# Altium schematic sheet Sheet5.SchDoc
size B
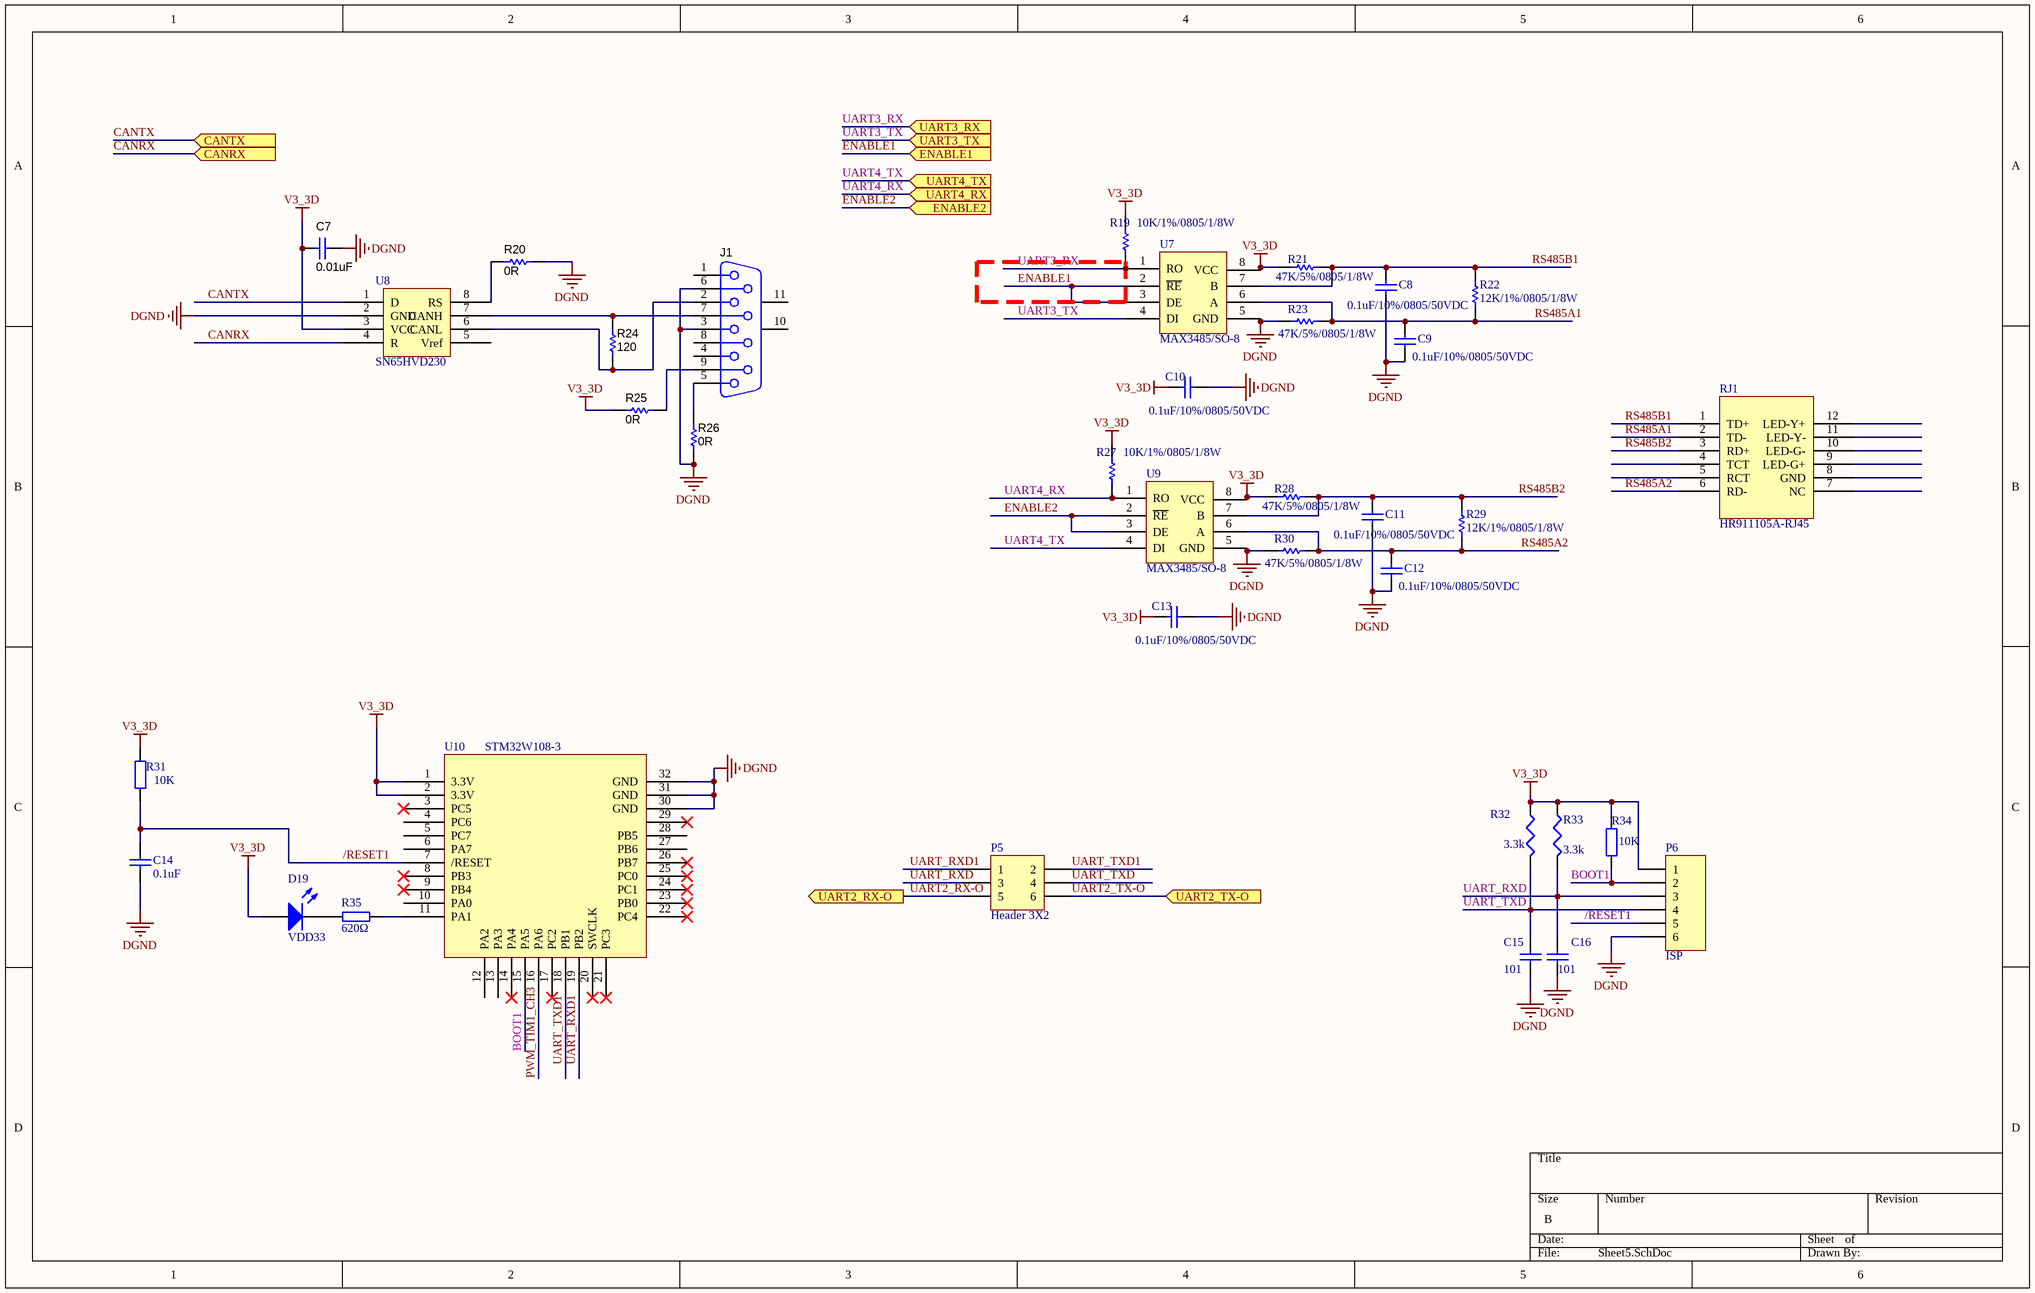
[diagram p0: Sheet5.SchDoc]

## Parts
C7  ValueDisplayed: 0.01uF  [0805_cap]
C8  0.1uF/10%/0805/50VDC  [C-0805]
C9  0.1uF/10%/0805/50VDC  [C-0805]
C10  0.1uF/10%/0805/50VDC  [C-0805]
C11  0.1uF/10%/0805/50VDC  [C-0805]
C12  0.1uF/10%/0805/50VDC  [C-0805]
C13  0.1uF/10%/0805/50VDC  [C-0805]
C14  0.1uF  [C0805]
C15  101  [C0805]
C16  101  [C0805]
D19  VDD33  [0805LED]
J1  (no value)  [CONN_1734348-1]
P5  Header 3X2  [HDR2X3]
P6  ISP  [SIP-6B]
R19  10K/1%/0805/1/8W  [R-0805]
R20  value 0R  [0805_HV]  (hidden comment: CRCW080560R4FKEA)
R21  47K/5%/0805/1/8W  [R-0805]
R22  12K/1%/0805/1/8W  [R-0805]
R23  47K/5%/0805/1/8W  [R-0805]
R24  value 120  [0805_HV]  (hidden comment: CRCW080560R4FKEA)
R25  value 0R  [0805_HV]  (hidden comment: CRCW080560R4FKEA)
R26  value 0R  [0805_HV]  (hidden comment: CRCW080560R4FKEA)
R27  10K/1%/0805/1/8W  [R-0805]
R28  47K/5%/0805/1/8W  [R-0805]
R29  12K/1%/0805/1/8W  [R-0805]
R30  47K/5%/0805/1/8W  [R-0805]
R31  value 10K  [0805]  (hidden comment: Res2)
R32  3.3k  [R0805]
R33  3.3k  [R0805]
R34  value 10K  [R0805]  (hidden comment: Res2)
R35  620Ω  [R0805]
RJ1  HR911105A-RJ45  [HR911105A]
U7  MAX3485/SO-8  [SO-G8]
U8  SN65HVD230  [SO-G8]
U9  MAX3485/SO-8  [SO-G8]
U10  STM32W108-3  [STM32W108-3]

## Ports
CANRX (in), CANTX (in), ENABLE1 (in), ENABLE2 (in), UART2_RX-O (out), UART2_TX-O (in), UART3_RX (in), UART3_TX (in), UART4_RX (in), UART4_TX (in)

## Nets
DGND: C7.2 C8.1 C9.1 C10.2 C11.1 C12.1 C13.2 C14.1 C15.1 C16.1 J1.3 J1.6 P6.6 R20.2 R23.2 R26.1 R30.2 U7.5(GND) U8.2(GND) U9.5(GND) U10.30(GND) U10.31(GND) U10.32(GND)
V3_3D: C7.1 C10.1 C13.1 D19.1(A) P6.1 R19.2 R21.2 R25.2 R27.2 R28.2 R31.2 R32.1 R33.1 R34.2 U7.8(VCC) U8.3(VCC) U9.8(VCC) U10.1(3.3V) U10.2(3.3V)
/RESET1: C14.2 P6.5 R31.1 U10.7(/RESET)
BOOT1: P6.2 R34.1 U10.15(PA5)
CANRX: U8.4(R) ; port CANRX
CANTX: U8.1(D) ; port CANTX
ENABLE1: U7.2(~{RE}) U7.3(DE) ; port ENABLE1
ENABLE2: U9.2(~{RE}) U9.3(DE) ; port ENABLE2
PWM_TIM1_CH3: U10.16(PA6)
RS485A1: C9.2 R22.1 R23.1 RJ1.2(TD-) U7.6(A)
RS485A2: C12.2 R29.1 R30.1 RJ1.6(RD-) U9.6(A)
RS485B1: C8.2 R21.1 R22.2 RJ1.1(TD+) U7.7(B)
RS485B2: C11.2 R28.1 R29.2 RJ1.3(RD+) U9.7(B)
UART2_RX-O: P5.5 ; port UART2_RX-O
UART2_TX-O: P5.6 ; port UART2_TX-O
UART3_RX: R19.1 U7.1(RO) ; port UART3_RX
UART3_TX: U7.4(DI) ; port UART3_TX
UART4_RX: R27.1 U9.1(RO) ; port UART4_RX
UART4_TX: U9.4(DI) ; port UART4_TX
UART_RXD: C16.2 P5.3 P6.3 R33.2
UART_RXD1: P5.1 U10.19(PB2)
UART_TXD: C15.2 P5.4 P6.4 R32.2
UART_TXD1: P5.2 U10.18(PB1)
NetD19_2: D19.2(K) R35.2
NetJ1_2: J1.2 R24.2 U8.6(CANL)
NetJ1_5: J1.5 R26.2
NetJ1_7: J1.7 R24.1 U8.7(CANH)
NetJ1_9: J1.9 R25.1
NetR20_1: R20.1 U8.8(RS)
NetR35_1: R35.1 U10.11(PA1)

Not connected (* = marked no-connect by the designer): J1 1 4 8 10(MH1) 11(MH2); RJ1 4(TCT) 5(RCT) 7(NC) 8(GND) 9(LED-G+) 10(LED-G-) 11(LED-Y-) 12(LED-Y+); U8 5(Vref); U10 3(PC5)* 4(PC6) 5(PC7) 6(PA7) 8(PB3)* 9(PB4)* 10(PA0) 12(PA2) 13(PA3) 14(PA4)* 17(PC2)* 20(SWCLK)* 21(PC3)* 22(PC4)* 23(PB0)* 24(PC1)* 25(PC0)* 26(PB7)* 27(PB6) 28(PB5) 29*

## Library data of the parts
C7 = C1005X7R1C103K: CAP, CERM, 0.01uF, 16V, +/-10%, X7R, 0402; Manufacturer: TDK; Polarized: N; CompType: Capacitor; U/M: EA; Cap_F: 0.00000001; Tolerance_%: 10; ESR_Ohm: 0.0623; Value1: 0.0623 ohm; VDC_V: 16; TaMin_C: -55; TaMax_C: 125; Cap_Case: 0402; SymbolVersion: 2008-07-09; Value: 0.01uF; PartNumber: C1005X7R1C103K; PackageReference: 0402; RoHS: Y; Value2: 16V; MountType: SMT; Technology: Ceramic; Published: 2008-06-19; Publisher: Texas Instruments; LatestRevisionDate: 2013-04-19; LatestRevisionNote: Changed publisher; ComponentLink1Description: Datasheet link; ComponentLink1URL: http://www.tdk.co.jp/tefe02/e412_c.pdf; Supplier 1: Digi-Key; Supplier Part Number 1: 445-1262-1-ND; Supplier 2: Farnell; Supplier Part Number 2: 1844125
C8-C13 = ASC-0024CA: 名称: 贴片电容; 型号: CGA4J2X8R1H104K125AA; 品牌: TDK; 规格: 0.1uF/10%/0805/50VDC
C14-C16 = Cap: Capacitor; Value: 100pF; Published: 8-Jun-2000; LatestRevisionDate: 17-Jul-2002; LatestRevisionNote: Re-released for DXP Platform.; Publisher: Altium Limited
D19 = LED3: Typical BLUE SiC LED; Published: 8-Jun-2000; LatestRevisionDate: 17-Dec-2003; LatestRevisionNote: PCB Footprint replaced.; Publisher: Altium Limited
J1 = 1734348-1: Conn D-SUB RCPT R/A 9POS GOLD/FL, TH; Manufacturer: TE Connectivity; SymbolCreator: a0412235; CompType: Connector; U/M: EA; SymbolVersion: 2012-11-29; PartNumber: 1734348-1; RoHS: Y; PackageReference: D-SUB 9 PIN; MountType: TH; ComponentLink1Description: Datasheet Link; ComponentLink1URL: http://www.te.com/commerce/DocumentDelivery/DDEController?Action=showdoc&DocId=Customer+Drawing%7F1734348%7FB1%7Fpdf%7FEnglish%7FENG_CD_1734348_B1.pdf%7F1734348-1; Publisher: Texas Instruments; LatestRevisionDate: 2013-04-26; Supplier 1: Digi-Key; Supplier Part Number 1: A35109-ND; Supplier 2: Mouser; Supplier Part Number 2: 571-1734348-1; Supplier 3: Farnell; Supplier Part Number 3: 2133699
P5 = Header 3X2: Header, 3-Pin, Dual row; LatestRevisionDate: 17-Jul-2002; LatestRevisionNote: Re-released for DXP Platform.; Publisher: Altium Limited
P6 = Header 6: Header, 6-Pin; LatestRevisionDate: 17-Jul-2002; LatestRevisionNote: Re-released for DXP Platform.; Publisher: Altium Limited
R19 R27 = ASR-0030AA: Part Number: ASR-0028BA; 名称: 贴片电阻; 型号: RC0805FR-0710KL; 品牌: YAGEO; 规格: 10K/1%/0805/1/8W
R20 R25 R26 = CRCW080560R4FKEA: RES, 0 ohm, 1%, 0.125W, 0805; Manufacturer: Vishay-Dale; CompType: Resistor; Res_ohm: 60.4; Value_Code: 60R4; Tolerance_%: 1; Power_W: 0.125; VDC_V: 150; TempCo: 100 ppm/C; EIA_Code: E96; U/M: EA; SymbolVersion: 2009-05-29; PartNumber: CRCW080560R4FKEA; PackageReference: 0805; RoHS: Y; Value1: 1%; Value2: 0.125W; MountType: SMT; Technology: Thick Film; Published: 2008-06-26; Publisher: Texas Instruments; LatestRevisionDate: 2013-04-18; ComponentLink1Description: Datasheet link; ComponentLink1URL: http://www.vishay.com/docs/20035/dcrcwe3.pdf; Supplier 1: Digi-Key; Supplier Part Number 1: 541-60.4CCT-ND; Supplier 2: Mouser; Supplier Part Number 2: 71-CRCW0805-60.4-E3; Supplier 3: Farnell; Supplier Part Number 3: 1469951
R21 R23 R28 R30 = ASR-0134BA: 名称: 贴片电阻; 型号: RC0805JR-0747KL; 品牌: YAGEO; Part Number: ASR-0134BA; 规格: 47K/5%/0805/1/8W
R22 R29 = ASR-0028BA: 名称: 贴片电阻; 品牌: YAGEO; 规格: 12K/1%/0805/1/8W
R24 = CRCW080560R4FKEA: RES, 120ohm, 1%, 0.125W, 0805; Manufacturer: Vishay-Dale; CompType: Resistor; Res_ohm: 60.4; Value_Code: 60R4; Tolerance_%: 1; Power_W: 0.125; VDC_V: 150; TempCo: 100 ppm/C; EIA_Code: E96; U/M: EA; SymbolVersion: 2009-05-29; PartNumber: CRCW080560R4FKEA; PackageReference: 0805; RoHS: Y; Value1: 1%; Value2: 0.125W; MountType: SMT; Technology: Thick Film; Published: 2008-06-26; Publisher: Texas Instruments; LatestRevisionDate: 2013-04-18; ComponentLink1Description: Datasheet link; ComponentLink1URL: http://www.vishay.com/docs/20035/dcrcwe3.pdf; Supplier 1: Digi-Key; Supplier Part Number 1: 541-60.4CCT-ND; Supplier 2: Mouser; Supplier Part Number 2: 71-CRCW0805-60.4-E3; Supplier 3: Farnell; Supplier Part Number 3: 1469951
R31 R34 = Res2: Resistor; Published: 8-Jun-2000; LatestRevisionDate: 17-Jul-2002; LatestRevisionNote: Re-released for DXP Platform.; PackageReference: AXIAL-0.4; Publisher: Altium Limited
R32 R33 = Res3: Resistor; Value: 1K; Published: 8-Jun-2000; LatestRevisionDate: 17-Jul-2002; LatestRevisionNote: Re-released for DXP Platform.; Publisher: Altium Limited
R35 = RES: R
U7 U9 = MAX485: 名称: 485通讯; 规格: SO-8; 型号: MAX3485; 品牌: *; Part Number: *